# Altium project Basic FPGA.PrjPcb (part 1 of 2)
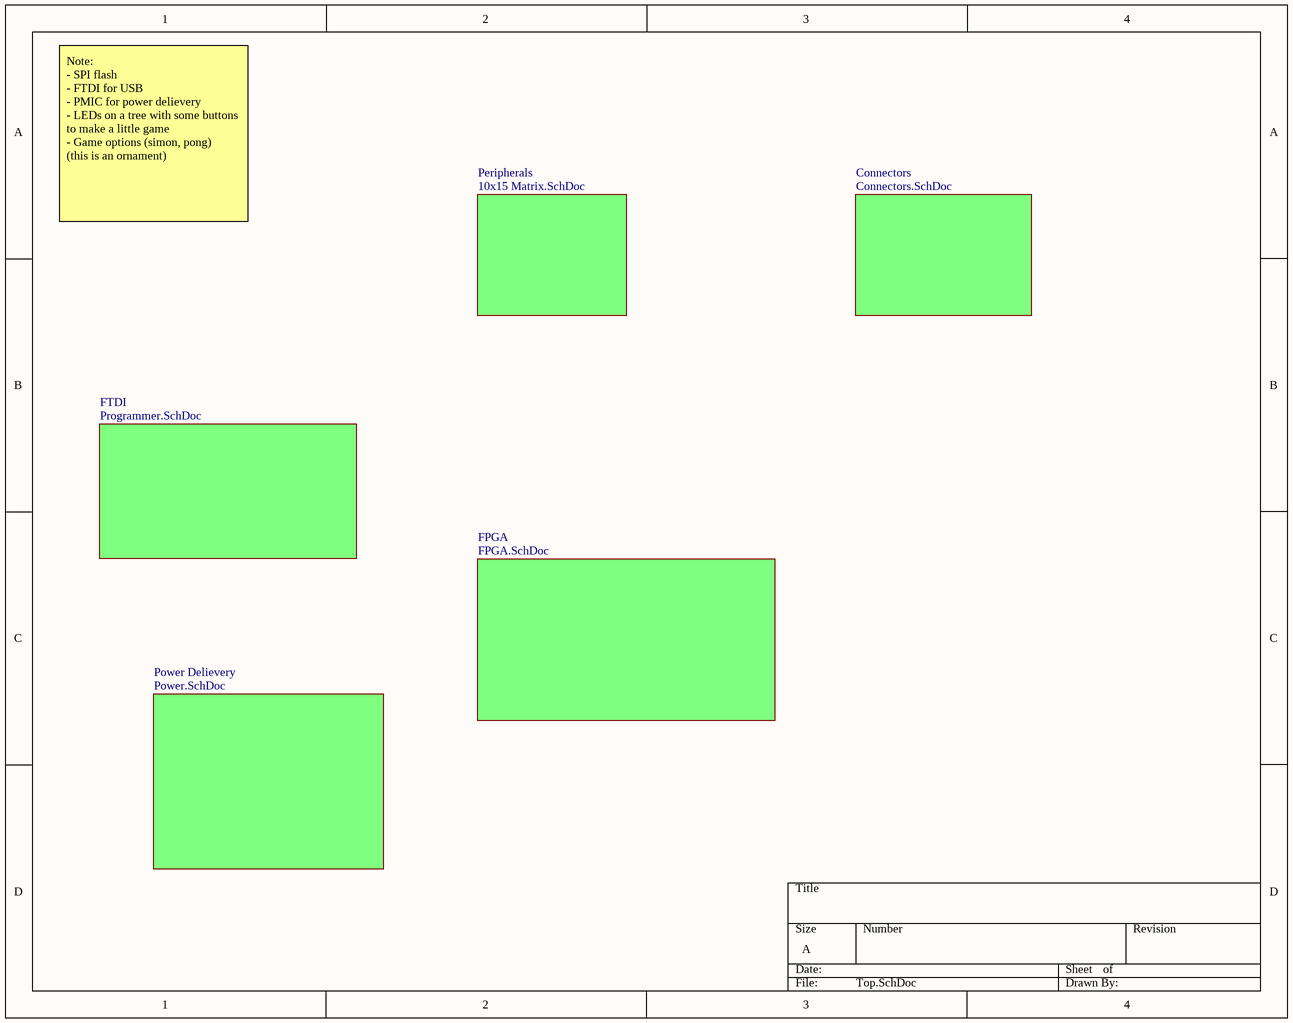
[diagram p0: Top.SchDoc]
6 sheets, 251 parts. Net scope: flat (ports and power ports of the same name join across sheets).
Board files: DevBoard.PcbDoc, Copy of ProductionBoard.PcbDoc, LEDMatrix.PcbDoc
Sheets:
  Top.SchDoc
    FPGA = FPGA.SchDoc
    FTDI = Programmer.SchDoc
    Peripherals = 10x15 Matrix.SchDoc
    Connectors = Connectors.SchDoc
    Power Delievery = Power.SchDoc

## Sheet Top.SchDoc
size A

### Sub-sheets
Connectors = Connectors.SchDoc: no entries
FPGA = FPGA.SchDoc: no entries
FTDI = Programmer.SchDoc: no entries
Peripherals = 10x15 Matrix.SchDoc: no entries
Power Delievery = Power.SchDoc: no entries

### Notes on the sheet
- Note:
  - SPI flash
  - FTDI for USB
  - PMIC for power delievery
  - LEDs on a tree with some buttons to make a little game
  - Game options (simon, pong)
  (this is an ornament)

## Sheet FPGA.SchDoc
size A
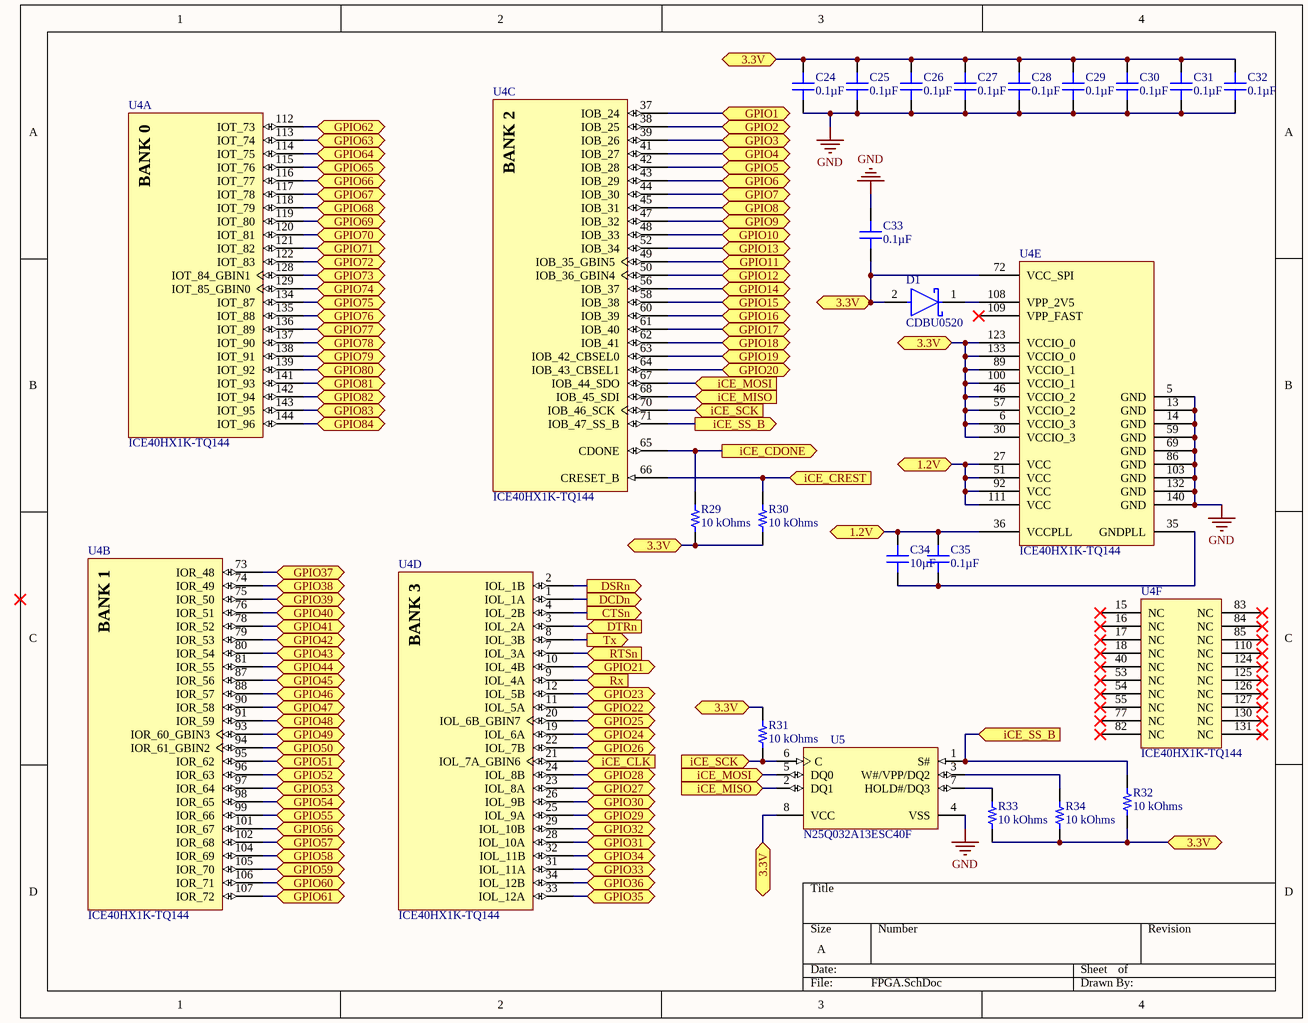
[diagram p1: FPGA.SchDoc]

### Parts
C24  0.1µF  [CAP 0805_2012]
C25  0.1µF  [CAP 0805_2012]
C26  0.1µF  [CAP 0805_2012]
C27  0.1µF  [CAP 0805_2012]
C28  0.1µF  [CAP 0805_2012]
C29  0.1µF  [CAP 0805_2012]
C30  0.1µF  [CAP 0805_2012]
C31  0.1µF  [CAP 0805_2012]
C32  0.1µF  [CAP 0805_2012]
C33  0.1µF  [CAP 0805_2012]
C34  10µF  [CAP 0805_2012]
C35  0.1µF  [CAP 0805_2012]
D1  CDBU0520  [FP-0603-SOD-523F-MFG]
R29  10 kOhms  [RES 0805_2012]
R30  10 kOhms  [RES 0805_2012]
R31  10 kOhms  [RES 0805_2012]
R32  10 kOhms  [RES 0805_2012]
R33  10 kOhms  [RES 0805_2012]
R34  10 kOhms  [RES 0805_2012]
U4  ICE40HX1K-TQ144  [LATC-TQFP-144_L]  (parts A,B,C,D,E,F of 6)
U5  N25Q032A13ESC40F  [MICT-SC-8_N]

### Ports
1.2V (bidir), 3.3V (bidir), CTSn (out), DCDn (out), DSRn (out), DTRn (in), GPIO1 (bidir), GPIO2 (bidir), GPIO3 (bidir), GPIO4 (bidir), GPIO5 (bidir), GPIO6 (bidir), GPIO7 (bidir), GPIO8 (bidir), GPIO9 (bidir), GPIO10 (bidir), GPIO11 (bidir), GPIO12 (bidir), GPIO13 (bidir), GPIO14 (bidir), GPIO15 (bidir), GPIO16 (bidir), GPIO17 (bidir), GPIO18 (bidir), GPIO19 (bidir), GPIO20 (bidir), GPIO21 (bidir), GPIO22 (bidir), GPIO23 (bidir), GPIO24 (bidir), GPIO25 (bidir), GPIO26 (bidir), GPIO27 (bidir), GPIO28 (bidir), GPIO29 (bidir), GPIO30 (bidir), GPIO31 (bidir), GPIO32 (bidir), GPIO33 (bidir), GPIO34 (bidir), GPIO35 (bidir), GPIO36 (bidir), GPIO37 (bidir), GPIO38 (bidir), GPIO39 (bidir), GPIO40 (bidir), GPIO41 (bidir), GPIO42 (bidir), GPIO43 (bidir), GPIO44 (bidir), GPIO45 (bidir), GPIO46 (bidir), GPIO47 (bidir), GPIO48 (bidir), GPIO49 (bidir), GPIO50 (bidir), GPIO51 (bidir), GPIO52 (bidir), GPIO53 (bidir), GPIO54 (bidir), GPIO55 (bidir), GPIO56 (bidir), GPIO57 (bidir), GPIO58 (bidir), GPIO59 (bidir), GPIO60 (bidir), GPIO61 (bidir), GPIO62 (bidir), GPIO63 (bidir), GPIO64 (bidir), GPIO65 (bidir), GPIO66 (bidir), GPIO67 (bidir), GPIO68 (bidir), GPIO69 (bidir), GPIO70 (bidir), GPIO71 (bidir), GPIO72 (bidir), GPIO73 (bidir), GPIO74 (bidir), GPIO75 (bidir), GPIO76 (bidir), GPIO77 (bidir), GPIO78 (bidir), GPIO79 (bidir), GPIO80 (bidir), GPIO81 (bidir), GPIO82 (bidir), GPIO83 (bidir), GPIO84 (bidir), iCE_CDONE (out), iCE_CLK (in), iCE_CREST (in), iCE_MISO (in), iCE_MOSI (in), iCE_SCK (in), iCE_SS_B (in), iCE_SS_B (out), RTSn (in), Rx (in), Tx (out)

### Nets
GND: C24.1 C25.1 C26.1 C27.1 C28.1 C29.1 C30.1 C31.1 C32.1 C33.2 U4.5(GND) U4.13(GND) U4.14(GND) U4.59(GND) U4.69(GND) U4.86(GND) U4.103(GND) U4.132(GND) U4.140(GND) U5.4(VSS)
Net*_4: C24.2 C25.2 C26.2 C27.2 C28.2 C29.2 C30.2 C31.2 C32.2 C33.1 D1.2(A) R29.2 R30.2 R31.2 R32.1 R33.1 R34.1 U4.6(VCCIO_3) U4.30(VCCIO_3) U4.46(VCCIO_2) U4.57(VCCIO_2) U4.72(VCC_SPI) U4.89(VCCIO_1) U4.100(VCCIO_1) U4.123(VCCIO_0) U4.133(VCCIO_0) U5.8(VCC) ; port 3.3V
NetC1_2: C34.2 C35.2 U4.27(VCC) U4.36(VCCPLL) U4.51(VCC) U4.92(VCC) U4.111(VCC) ; port 1.2V
NetC34_1: C34.1 C35.1 U4.35(GNDPLL)
NetD1_1: D1.1(C) U4.108(VPP_2V5)
NetD2_1: U4.73(IOR_48) ; port GPIO37
NetD17_1: U4.74(IOR_49) ; port GPIO38
NetD32_1: U4.75(IOR_50) ; port GPIO39
NetD47_1: U4.76(IOR_51) ; port GPIO40
NetD62_1: U4.78(IOR_52) ; port GPIO41
NetD77_1: U4.79(IOR_53) ; port GPIO42
NetD92_1: U4.80(IOR_54) ; port GPIO43
NetD107_1: U4.81(IOR_55) ; port GPIO44
NetD122_1: U4.87(IOR_56) ; port GPIO45
NetD137_1: U4.88(IOR_57) ; port GPIO46
NetP1_1: U4.112(IOT_73) ; port GPIO62
NetP1_2: U4.113(IOT_74) ; port GPIO63
NetP1_3: U4.114(IOT_75) ; port GPIO64
NetP1_4: U4.115(IOT_76) ; port GPIO65
NetP1_5: U4.116(IOT_77) ; port GPIO66
NetP1_6: U4.117(IOT_78) ; port GPIO67
NetP1_7: U4.118(IOT_79) ; port GPIO68
NetP1_8: U4.119(IOT_80) ; port GPIO69
NetP1_9: U4.120(IOT_81) ; port GPIO70
NetP1_10: U4.121(IOT_82) ; port GPIO71
NetP1_11: U4.122(IOT_83) ; port GPIO72
NetP1_12: U4.128(IOT_84_GBIN1) ; port GPIO73
NetP1_13: U4.129(IOT_85_GBIN0) ; port GPIO74
NetP3_1: U4.37(IOB_24) ; port GPIO1
NetP3_2: U4.38(IOB_25) ; port GPIO2
NetP3_3: U4.39(IOB_26) ; port GPIO3
NetP3_4: U4.41(IOB_27) ; port GPIO4
NetP3_5: U4.42(IOB_28) ; port GPIO5
NetP3_6: U4.43(IOB_29) ; port GPIO6
NetP3_7: U4.44(IOB_30) ; port GPIO7
NetP3_8: U4.45(IOB_31) ; port GPIO8
NetP3_9: U4.47(IOB_32) ; port GPIO9
NetP3_10: U4.48(IOB_33) ; port GPIO10
NetP4_1: U4.10(IOL_4B) ; port GPIO21
NetP4_2: U4.11(IOL_5A) ; port GPIO22
NetP4_3: U4.12(IOL_5B) ; port GPIO23
NetP4_4: U4.19(IOL_6A) ; port GPIO24
NetP4_5: U4.20(IOL_6B_GBIN7) ; port GPIO25
NetP4_6: U4.22(IOL_7B) ; port GPIO26
NetP4_7: U4.23(IOL_8A) ; port GPIO27
NetP4_8: U4.24(IOL_8B) ; port GPIO28
NetP4_9: U4.25(IOL_9A) ; port GPIO29
NetP4_10: U4.26(IOL_9B) ; port GPIO30
NetP4_11: U4.28(IOL_10A) ; port GPIO31
NetP4_12: U4.29(IOL_10B) ; port GPIO32
NetP4_13: U4.31(IOL_11A) ; port GPIO33
NetP4_14: U4.32(IOL_11B) ; port GPIO34
NetP4_15: U4.33(IOL_12A) ; port GPIO35
NetP4_16: U4.34(IOL_12B) ; port GPIO36
NetP5_1: U4.134(IOT_87) ; port GPIO75
NetP5_2: U4.135(IOT_88) ; port GPIO76
NetP5_3: U4.136(IOT_89) ; port GPIO77
NetP5_4: U4.137(IOT_90) ; port GPIO78
NetP5_5: U4.138(IOT_91) ; port GPIO79
NetP5_6: U4.139(IOT_92) ; port GPIO80
NetP5_7: U4.141(IOT_93) ; port GPIO81
NetP5_8: U4.142(IOT_94) ; port GPIO82
NetP5_9: U4.143(IOT_95) ; port GPIO83
NetP5_10: U4.144(IOT_96) ; port GPIO84
NetP6_1: U4.90(IOR_58) ; port GPIO47
NetP6_2: U4.91(IOR_59) ; port GPIO48
NetP6_3: U4.93(IOR_60_GBIN3) ; port GPIO49
NetP6_4: U4.94(IOR_61_GBIN2) ; port GPIO50
NetP6_5: U4.95(IOR_62) ; port GPIO51
NetP6_6: U4.96(IOR_63) ; port GPIO52
NetP6_7: U4.97(IOR_64) ; port GPIO53
NetP6_8: U4.98(IOR_65) ; port GPIO54
NetP6_9: U4.99(IOR_66) ; port GPIO55
NetP6_10: U4.101(IOR_67) ; port GPIO56
NetP6_11: U4.102(IOR_68) ; port GPIO57
NetP6_12: U4.104(IOR_69) ; port GPIO58
NetP6_13: U4.105(IOR_70) ; port GPIO59
NetP6_14: U4.106(IOR_71) ; port GPIO60
NetP6_15: U4.107(IOR_72) ; port GPIO61
NetP7_1: U4.49(IOB_35_GBIN5) ; port GPIO11
NetP7_2: U4.50(IOB_36_GBIN4) ; port GPIO12
NetP7_3: U4.52(IOB_34) ; port GPIO13
NetP7_4: U4.56(IOB_37) ; port GPIO14
NetP7_5: U4.58(IOB_38) ; port GPIO15
NetP7_6: U4.60(IOB_39) ; port GPIO16
NetP7_7: U4.61(IOB_40) ; port GPIO17
NetP7_8: U4.62(IOB_41) ; port GPIO18
NetP7_9: U4.63(IOB_42_CBSEL0) ; port GPIO19
NetP7_10: U4.64(IOB_43_CBSEL1) ; port GPIO20
NetR9_1: R31.1 U4.70(IOB_46_SCK) U5.6(C) ; port iCE_SCK
NetR10_1: U4.67(IOB_44_SDO) U5.5(DQ0) ; port iCE_MOSI
NetR11_1: U4.68(IOB_45_SDI) U5.2(DQ1) ; port iCE_MISO
NetR12_1: R32.2 U4.71(IOB_47_SS_B) U5.1(S#) ; port iCE_SS_B
NetR13_1: R29.1 U4.65(CDONE) ; port iCE_CDONE
NetR14_1: R30.1 U4.66(CRESET_B) ; port iCE_CREST
NetR20_1: U4.9(IOL_4A) ; port Rx
NetR21_1: U4.8(IOL_3B) ; port Tx
NetR22_1: U4.7(IOL_3A) ; port RTSn
NetR23_1: U4.4(IOL_2B) ; port CTSn
NetR24_1: U4.3(IOL_2A) ; port DTRn
NetR25_1: U4.2(IOL_1B) ; port DSRn
NetR26_1: U4.1(IOL_1A) ; port DCDn
NetR28_1: U4.21(IOL_7A_GBIN6) ; port iCE_CLK
NetR33_2: R33.2 U5.7(HOLD#/DQ3)
NetR34_2: R34.2 U5.3(W#/VPP/DQ2)

Not connected (* = marked no-connect by the designer): U4 15(NC)* 16(NC)* 17(NC)* 18(NC)* 40(NC)* 53(NC)* 54(NC)* 55(NC)* 77(NC)* 82(NC)* 83(NC)* 84(NC)* 85(NC)* 109(VPP_FAST)* 110(NC)* 124(NC)* 125(NC)* 126(NC)* 127(NC)* 130(NC)* 131(NC)*

### Notes on the sheet
- (in symbol CMP-0962-00009-1, part A) BANK 0
- (in symbol CMP-0962-00009-1, part B) BANK 1
- (in symbol CMP-0962-00009-1, part C) BANK 2
- (in symbol CMP-0962-00009-1, part D) BANK 3

### Library data of the parts
C24-C33 C35 = CL21B104KBCNNNC: CAP CER 0.1UF 50V X7R 0805; Manufacturer: Samsung Electro-Mechanics; Tolerance: ±10%; Part Number: CL21B104KBCNNNC; Value: 0.1µF; Applications: General Purpose; Capacitance: 0.1µF; ComponentLink1Description: Datasheet; ComponentLink1URL: http://www.samsungsem.com/kr/support/product-search/mlcc/CL21B104KBCNNNC.jsp; ComponentLink2Description: DigiKey Link; ComponentLink2URL: http://digikey.com/product-detail/en/samsung-electro-mechanics/CL21B104KBCNNNC/1276-1003-1-ND/3889089; Device Package: 0805 (2012 Metric); LastUpdated: 9/2/2020 1:04:35 AM; Lifecycle Status: Active; Minimum Order: 1; Mounting Type: Surface Mount, MLCC; Operating Temperature: -55°C ~ 125°C; Package / Case: 0805 (2012 Metric); Packaging: TapeAndReel; PartId: 6201; Part Status: Active; Price: 0.01; Series: CL; Size / Dimension: 0.079" L x 0.049" W (2.00mm x 1.25mm); Supplier 1: DigiKey; Supplier Part Number 1: 1276-1003-1-ND; Temperature Coefficient: X7R; Thickness (Max): 0.037" (0.95mm); Voltage - Rated: 50V
C34 = CL21A106KOQNNNG: CAP CER 10UF 16V X5R 0805; Manufacturer: Samsung Electro-Mechanics; Tolerance: ±10%; Part Number: CL21A106KOQNNNG; Value: 10µF; Applications: General Purpose; Capacitance: 10µF; ComponentLink1Description: Datasheet; ComponentLink1URL: http://www.samsungsem.com/kr/support/product-search/mlcc/CL21A106KOQNNNG.jsp; ComponentLink2Description: DigiKey Link; ComponentLink2URL: http://digikey.com/product-detail/en/samsung-electro-mechanics/CL21A106KOQNNNG/1276-6455-1-ND/5958083; Device Package: 0805 (2012 Metric); LastUpdated: 9/2/2020 1:04:35 AM; Lifecycle Status: Active; Minimum Order: 1; Mounting Type: Surface Mount, MLCC; Operating Temperature: -55°C ~ 85°C; Package / Case: 0805 (2012 Metric); Packaging: TapeAndReel; PartId: 6236; Part Status: Active; Price: 0.02; Series: CL; Size / Dimension: 0.079" L x 0.049" W (2.00mm x 1.25mm); Supplier 1: DigiKey; Supplier Part Number 1: 1276-6455-1-ND; Temperature Coefficient: X5R; Thickness (Max): 0.055" (1.40mm); Voltage - Rated: 16V
D1 = CMP-20227-000003-1: DIODE SCHOTTKY 20V 500MA 0603; Max Surge Current: 2A; Max Reverse Leakage Current: 100uA; Package Quantity: 1; Packaging: Tape and Reel; Mount: Surface Mount; Max Reverse Voltage (DC): 20V; Average Rectified Current: 500mA; Case/Package: SMD/SMT
R29-R34 = RNCP0805FTD10K0: RES 10K OHM 1% 1/4W 0805; Manufacturer: Stackpole Electronics Inc; Power (Watts): 0.25W, 1/4W; Temperature Coefficient: ±100ppm/°C; Part Number: RNCP0805FTD10K0; Value: 10 kOhms; ComponentLink1Description: Datasheet; ComponentLink1URL: https://www.seielect.com/catalog/sei-rncp.pdf; ComponentLink2Description: DigiKey Link; ComponentLink2URL: http://digikey.com/product-detail/en/stackpole-electronics-inc/RNCP0805FTD10K0/RNCP0805FTD10K0CT-ND/2240601; Composition: Thin Film; Device Package: 0805 (2012 Metric); Features: Anti-Sulfur, Moisture Resistant; Height - Seated (Max): 0.024" (0.60mm); LastUpdated: 9/2/2020 1:15:23 AM; Lifecycle Status: Active; Minimum Order: 1; Number of Terminations: 2; Operating Temperature: -55°C ~ 155°C; Package / Case: 0805 (2012 Metric); Packaging: TapeAndReel; PartId: 28021; Part Status: Active; Price: 0.01; Resistance: 10 kOhms; Series: RNCP; Size / Dimension: 0.079" L x 0.049" W (2.00mm x 1.25mm); Supplier 1: DigiKey; Supplier Part Number 1: RNCP0805FTD10K0CT-ND; Supplier Device Package: 0805; Tolerance: ±1%
U4 = CMP-0962-00009-1: iCE40 HX1K Series FPGA Family, 1280 Logic Cells, 1.2 V Core, 64 K Embedded RAM Bits, 144-pin TQFP, Pb-Free, Tray; Manufacturer: Lattice Semiconductor; Embedded RAM Bits: 64K; Logic Cells: 1280; Phase-Locked Loops: 1; Supply Voltage: 1.2V; Mounting Technology: Surface Mount; ComponentLink3URL: http://www.latticesemi.com/lit/docs/package/pkg.pdf; ComponentLink1URL: http://www.latticesemi.com/en; ComponentLink2Description: Datasheet; RoHS: TRUE; ComponentLink2URL: http://www.latticesemi.com/~/media/Documents/DataSheets/iCE/iCE40LPHXFamilyDataSheet.pdf; PackageVersion: Rev. 03.9, 02/2013; ComponentLink1Description: Manufacturer URL; PartNumber: ICE40HX1K-TQ144; DatasheetVersion: Rev. 02.9; PackageReference: TQFP-144; PackageDescription: 144-Pin Thin Quad Flat Package, Body 20 x 20 mm, Pitch 0.5 mm; Packing: Tray; ComponentLink3Description: Package Specification
U5 = CMP-0357-00152-1: 32 Mb (x1/x2/x4) Serial NOR Flash Memory with Multi I/O, 108 MHz, 2.7 to 3.6 V, 8-pin SO8 Narrow (SC), Tape & Reel; Manufacturer: Micron; Part Family: N25QÂ; Density: 32MbÂ; Speed: 108 MHzÂ; Voltage: 2.7V-3.6VÂ; PackageReference: MICT-SC-8; Width: x1/x2/x4Â; Mounting Technology: Surface Mount; ComponentLink2Description: Datasheet; PackageVersion: Rev. E; ComponentLink1Description: Manufacturer URL; PackageDescription: 8-Pin SO Narrow, 3.9 X 4.9 mm, Pitch 1.27 mm; ComponentLink2URL: http://www.micron.com/~/media/Documents/Products/Data%20Sheet/NOR%20Flash/Serial%20NOR/N25Q/n25q_32mb_3v_65nm.pdf; Part Status: ProductionÂ; Applications: EmbeddedÂ; ComponentLink1URL: http://www.micron.com/; PartNumber: N25Q032A13ESC40F; ComponentLink3Description: Package Specification; ComponentLink3URL: http://www.micron.com/~/media/Documents/Products/Data%20Sheet/NOR%20Flash/Serial%20NOR/N25Q/n25q_32mb_3v_65nm.pdf; Package: SO8 NarrowÂ; Type: Multi I/OÂ; DatasheetVersion: Rev. G; RoHS: YesÂ

## Sheet Programmer.SchDoc
size A
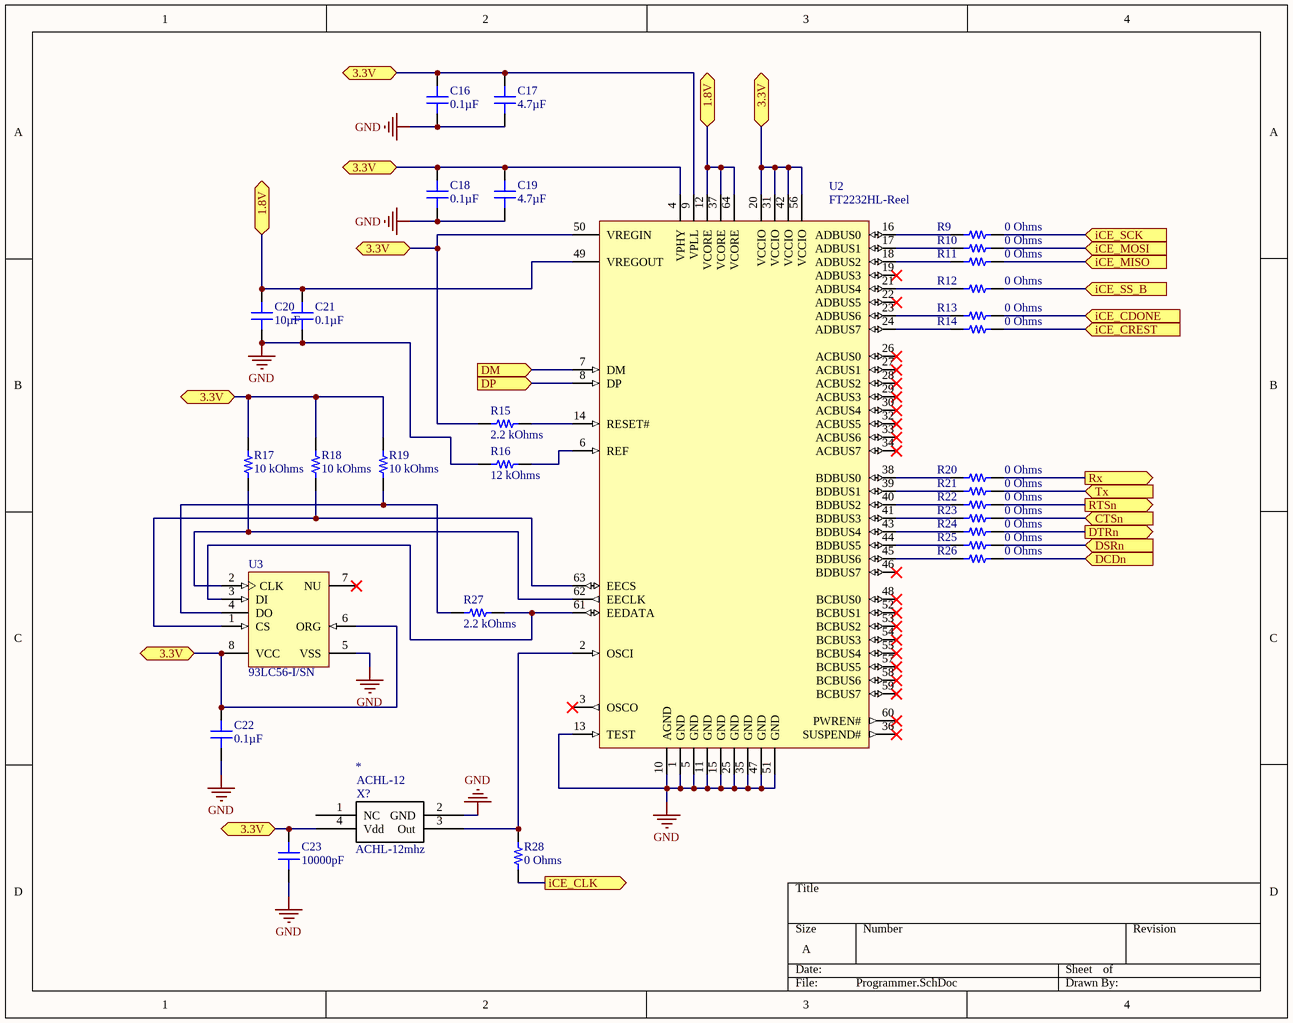
[diagram p2: Programmer.SchDoc]

### Parts
*  ACHL-12mhz  [ACHL-12mhz]
C16  0.1µF  [CAP 0805_2012]
C17  4.7µF  [CAP 0805_2012]
C18  0.1µF  [CAP 0805_2012]
C19  4.7µF  [CAP 0805_2012]
C20  10µF  [CAP 0805_2012]
C21  0.1µF  [CAP 0805_2012]
C22  0.1µF  [CAP 0805_2012]
C23  10000pF  [CAP 0805_2012]
R9  0 Ohms  [RES 0805_2012]
R10  0 Ohms  [RES 0805_2012]
R11  0 Ohms  [RES 0805_2012]
R12  0 Ohms  [RES 0805_2012]
R13  0 Ohms  [RES 0805_2012]
R14  0 Ohms  [RES 0805_2012]
R15  2.2 kOhms  [RES 0805_2012]
R16  12 kOhms  [RES 0805_2012]
R17  10 kOhms  [RES 0805_2012]
R18  10 kOhms  [RES 0805_2012]
R19  10 kOhms  [RES 0805_2012]
R20  0 Ohms  [RES 0805_2012]
R21  0 Ohms  [RES 0805_2012]
R22  0 Ohms  [RES 0805_2012]
R23  0 Ohms  [RES 0805_2012]
R24  0 Ohms  [RES 0805_2012]
R25  0 Ohms  [RES 0805_2012]
R26  0 Ohms  [RES 0805_2012]
R27  2.2 kOhms  [RES 0805_2012]
R28  0 Ohms  [RES 0805_2012]
U2  FT2232HL-Reel  [LQFP-64_M]
U3  93LC56-I/SN  [MCHP-SOIC-SN8_N]

### Ports
1.8V (bidir), 3.3V (bidir), CTSn (in), DCDn (in), DM (in), DP (in), DSRn (in), DTRn (out), iCE_CDONE (in), iCE_CLK (out), iCE_CREST (in), iCE_MISO (in), iCE_MOSI (in), iCE_SCK (in), iCE_SS_B (in), RTSn (out), Rx (out), Tx (in)

### Nets
GND: *.2(GND) C16.1 C17.1 C18.1 C19.1 C20.1 C21.1 C22.1 C23.1 R16.1 U2.1(GND) U2.5(GND) U2.10(AGND) U2.11(GND) U2.13(TEST) U2.15(GND) U2.25(GND) U2.35(GND) U2.47(GND) U2.51(GND) U3.5(VSS)
Net*_3: *.3(Out) R28.2 U2.2(OSCI)
Net*_4: *.4(Vdd) C16.2 C17.2 C18.2 C19.2 C22.2 C23.2 R15.1 R17.2 R18.2 R19.2 U2.4(VPHY) U2.9(VPLL) U2.20(VCCIO) U2.31(VCCIO) U2.42(VCCIO) U2.50(VREGIN) U2.56(VCCIO) U3.6(ORG) U3.8(VCC) ; port 3.3V
NetC20_2: C20.2 C21.2 U2.12(VCORE) U2.37(VCORE) U2.49(VREGOUT) U2.64(VCORE) ; port 1.8V
NetJ1_2: U2.7(DM) ; port DM
NetJ1_3: U2.8(DP) ; port DP
NetR9_1: R9.1 ; port iCE_SCK
NetR9_2: R9.2 U2.16(ADBUS0)
NetR10_1: R10.1 ; port iCE_MOSI
NetR10_2: R10.2 U2.17(ADBUS1)
NetR11_1: R11.1 ; port iCE_MISO
NetR11_2: R11.2 U2.18(ADBUS2)
NetR12_1: R12.1 ; port iCE_SS_B
NetR12_2: R12.2 U2.21(ADBUS4)
NetR13_1: R13.1 ; port iCE_CDONE
NetR13_2: R13.2 U2.23(ADBUS6)
NetR14_1: R14.1 ; port iCE_CREST
NetR14_2: R14.2 U2.24(ADBUS7)
NetR15_2: R15.2 U2.14(RESET#)
NetR16_2: R16.2 U2.6(REF)
NetR17_1: R17.1 U2.62(EECLK) U3.2(CLK)
NetR18_1: R18.1 U2.63(EECS) U3.1(CS)
NetR19_1: R19.1 R27.1 U3.4(DO)
NetR20_1: R20.1 ; port Rx
NetR20_2: R20.2 U2.38(BDBUS0)
NetR21_1: R21.1 ; port Tx
NetR21_2: R21.2 U2.39(BDBUS1)
NetR22_1: R22.1 ; port RTSn
NetR22_2: R22.2 U2.40(BDBUS2)
NetR23_1: R23.1 ; port CTSn
NetR23_2: R23.2 U2.41(BDBUS3)
NetR24_1: R24.1 ; port DTRn
NetR24_2: R24.2 U2.43(BDBUS4)
NetR25_1: R25.1 ; port DSRn
NetR25_2: R25.2 U2.44(BDBUS5)
NetR26_1: R26.1 ; port DCDn
NetR26_2: R26.2 U2.45(BDBUS6)
NetR27_2: R27.2 U2.61(EEDATA) U3.3(DI)
NetR28_1: R28.1 ; port iCE_CLK

Not connected (* = marked no-connect by the designer): * 1(NC); U2 3(OSCO)* 19(ADBUS3)* 22(ADBUS5)* 26(ACBUS0)* 27(ACBUS1)* 28(ACBUS2)* 29(ACBUS3)* 30(ACBUS4)* 32(ACBUS5)* 33(ACBUS6)* 34(ACBUS7)* 36(SUSPEND#)* 46(BDBUS7)* 48(BCBUS0)* 52(BCBUS1)* 53(BCBUS2)* 54(BCBUS3)* 55(BCBUS4)* 57(BCBUS5)* 58(BCBUS6)* 59(BCBUS7)* 60(PWREN#)*; U3 7(NU)*

### Notes on the sheet
- (in symbol ACHL-12mhz) ACHL-12; X?

### Library data of the parts
C16 C18 C21 C22 = CL21B104KBCNNNC: as C24 on sheet FPGA; Part Number: CL21B104KBCNNNC; Value: 0.1µF; Applications: General Purpose; Capacitance: 0.1µF; ComponentLink1Description: Datasheet; ComponentLink1URL: http://www.samsungsem.com/kr/support/product-search/mlcc/CL21B104KBCNNNC.jsp; ComponentLink2Description: DigiKey Link; ComponentLink2URL: http://digikey.com/product-detail/en/samsung-electro-mechanics/CL21B104KBCNNNC/1276-1003-1-ND/3889089; Device Package: 0805 (2012 Metric); LastUpdated: 9/2/2020 1:04:35 AM; Lifecycle Status: Active; Minimum Order: 1; Mounting Type: Surface Mount, MLCC; Operating Temperature: -55°C ~ 125°C; Package / Case: 0805 (2012 Metric); Packaging: TapeAndReel; PartId: 6201; Part Status: Active; Price: 0.01; Series: CL; Size / Dimension: 0.079" L x 0.049" W (2.00mm x 1.25mm); Supplier 1: DigiKey; Supplier Part Number 1: 1276-1003-1-ND; Temperature Coefficient: X7R; Thickness (Max): 0.037" (0.95mm); Voltage - Rated: 50V
C17 C19 = CL21A475KAQNNNE: CAP CER 4.7UF 25V X5R 0805; Manufacturer: Samsung Electro-Mechanics; Tolerance: ±10%; Part Number: CL21A475KAQNNNE; Value: 4.7µF; Applications: General Purpose; Capacitance: 4.7µF; ComponentLink1Description: Datasheet; ComponentLink1URL: http://www.samsungsem.com/kr/support/product-search/mlcc/CL21A475KAQNNNE.jsp; ComponentLink2Description: DigiKey Link; ComponentLink2URL: http://digikey.com/product-detail/en/samsung-electro-mechanics/CL21A475KAQNNNE/1276-1244-1-ND/3889330; Device Package: 0805 (2012 Metric); LastUpdated: 9/2/2020 1:04:19 AM; Lifecycle Status: Active; Minimum Order: 1; Mounting Type: Surface Mount, MLCC; Operating Temperature: -55°C ~ 85°C; Package / Case: 0805 (2012 Metric); Packaging: TapeAndReel; PartId: 14321; Part Status: Active; Price: 0.03; Series: CL; Size / Dimension: 0.079" L x 0.049" W (2.00mm x 1.25mm); Supplier 1: DigiKey; Supplier Part Number 1: 1276-1244-1-ND; Temperature Coefficient: X5R; Thickness (Max): 0.055" (1.40mm); Voltage - Rated: 25V
C20 = CL21A106KOQNNNG: as C34 on sheet FPGA; Part Number: CL21A106KOQNNNG; Value: 10µF; Applications: General Purpose; Capacitance: 10µF; ComponentLink1Description: Datasheet; ComponentLink1URL: http://www.samsungsem.com/kr/support/product-search/mlcc/CL21A106KOQNNNG.jsp; ComponentLink2Description: DigiKey Link; ComponentLink2URL: http://digikey.com/product-detail/en/samsung-electro-mechanics/CL21A106KOQNNNG/1276-6455-1-ND/5958083; Device Package: 0805 (2012 Metric); LastUpdated: 9/2/2020 1:04:35 AM; Lifecycle Status: Active; Minimum Order: 1; Mounting Type: Surface Mount, MLCC; Operating Temperature: -55°C ~ 85°C; Package / Case: 0805 (2012 Metric); Packaging: TapeAndReel; PartId: 6236; Part Status: Active; Price: 0.02; Series: CL; Size / Dimension: 0.079" L x 0.049" W (2.00mm x 1.25mm); Supplier 1: DigiKey; Supplier Part Number 1: 1276-6455-1-ND; Temperature Coefficient: X5R; Thickness (Max): 0.055" (1.40mm); Voltage - Rated: 16V
C23 = CL21B103KBANNNC: CAP CER 10000PF 50V X7R 0805; Manufacturer: Samsung Electro-Mechanics; Tolerance: ±10%; Part Number: CL21B103KBANNNC; Value: 10000pF; Applications: General Purpose; Capacitance: 10000pF; ComponentLink1Description: Datasheet; ComponentLink1URL: http://www.samsungsem.com/kr/support/product-search/mlcc/CL21B103KBANNNC.jsp; ComponentLink2Description: DigiKey Link; ComponentLink2URL: http://digikey.com/product-detail/en/samsung-electro-mechanics/CL21B103KBANNNC/1276-1015-1-ND/3889101; Device Package: 0805 (2012 Metric); LastUpdated: 9/2/2020 1:04:35 AM; Lifecycle Status: Active; Minimum Order: 1; Mounting Type: Surface Mount, MLCC; Operating Temperature: -55°C ~ 125°C; Package / Case: 0805 (2012 Metric); Packaging: TapeAndReel; PartId: 6199; Part Status: Active; Price: 0.01; Series: CL; Size / Dimension: 0.079" L x 0.049" W (2.00mm x 1.25mm); Supplier 1: DigiKey; Supplier Part Number 1: 1276-1015-1-ND; Temperature Coefficient: X7R; Thickness (Max): 0.030" (0.75mm); Voltage - Rated: 50V
R9-R14 R20-R26 R28 = RMCF0805ZT0R00: RES 0 OHM JUMPER 1/8W 0805; Manufacturer: Stackpole Electronics Inc; Power (Watts): 0.125W, 1/8W; Part Number: RMCF0805ZT0R00; Value: 0 Ohms; ComponentLink1Description: Datasheet; ComponentLink1URL: https://www.seielect.com/catalog/sei-packaging.pdf; ComponentLink2Description: DigiKey Link; ComponentLink2URL: http://digikey.com/product-detail/en/stackpole-electronics-inc/RMCF0805ZT0R00/RMCF0805ZT0R00CT-ND/1942606; Composition: Thick Film; Device Package: 0805 (2012 Metric); Features: Automotive AEC-Q200; Height - Seated (Max): 0.026" (0.65mm); LastUpdated: 9/2/2020 1:14:43 AM; Lifecycle Status: Active; Minimum Order: 1; Number of Terminations: 2; Operating Temperature: -55°C ~ 155°C; Package / Case: 0805 (2012 Metric); Packaging: CutTape; PartId: 46079; Part Status: Active; Price: 0.10; Ratings: AEC-Q200; Resistance: 0 Ohms; Series: RMCF; Size / Dimension: 0.079" L x 0.049" W (2.00mm x 1.25mm); Supplier 1: DigiKey; Supplier Part Number 1: RMCF0805ZT0R00CT-ND; Supplier Device Package: 0805; Tolerance: Jumper
R15 R27 = ESR10EZPJ222: RES SMD 2.2K OHM 5% 0.4W 0805; Manufacturer: Rohm Semiconductor; Power (Watts): 0.4W, 2/5W; Temperature Coefficient: ±200ppm/°C; Part Number: ESR10EZPJ222; Value: 2.2 kOhms; ComponentLink1Description: Datasheet; ComponentLink1URL: https://www.rohm.com/datasheet/ESR01MZPF/esr-e; ComponentLink2Description: DigiKey Link; ComponentLink2URL: http://digikey.com/product-detail/en/rohm-semiconductor/ESR10EZPJ222/RHM2.2KKCT-ND/1762991; Composition: Thick Film; Device Package: 0805 (2012 Metric); Features: Automotive AEC-Q200, Pulse Withstanding; Height - Seated (Max): 0.026" (0.65mm); LastUpdated: 9/2/2020 1:15:14 AM; Lifecycle Status: Active; Minimum Order: 1; Number of Terminations: 2; Operating Temperature: -55°C ~ 155°C; Package / Case: 0805 (2012 Metric); Packaging: TapeAndReel; PartId: 32275; Part Status: Active; Price: 0.01; Ratings: AEC-Q200; Resistance: 2.2 kOhms; Series: ESR; Size / Dimension: 0.079" L x 0.049" W (2.00mm x 1.25mm); Supplier 1: DigiKey; Supplier Part Number 1: RHM2.2KKCT-ND; Supplier Device Package: 0805; Tolerance: ±5%
R16 = CRG0805F12K: RES SMD 12K OHM 1% 1/8W 0805; Manufacturer: TE Connectivity Passive Product; Power (Watts): 0.125W, 1/8W; Temperature Coefficient: ±100ppm/°C; Part Number: CRG0805F12K; Value: 12 kOhms; ComponentLink1Description: Datasheet; ComponentLink1URL: https://www.te.com/commerce/DocumentDelivery/DDEController?Action=srchrtrv&DocNm=1773204&DocType=DS&DocLang=English; ComponentLink2Description: DigiKey Link; ComponentLink2URL: http://digikey.com/product-detail/en/te-connectivity-passive-product/CRG0805F12K/A126337CT-ND/7603392; Composition: Thick Film; Device Package: 0805 (2012 Metric); Height - Seated (Max): 0.026" (0.65mm); LastUpdated: 9/2/2020 1:14:43 AM; Lifecycle Status: Active; Minimum Order: 1; Number of Terminations: 2; Operating Temperature: -55°C ~ 155°C; Package / Case: 0805 (2012 Metric); Packaging: TapeAndReel; PartId: 46149; Part Status: Active; Price: 0.01; Resistance: 12 kOhms; Series: CRG, Neohm; Size / Dimension: 0.079" L x 0.049" W (2.00mm x 1.25mm); Supplier 1: DigiKey; Supplier Part Number 1: A126337CT-ND; Supplier Device Package: 0805; Tolerance: ±1%
R17-R19 = RNCP0805FTD10K0: as R29 on sheet FPGA; Part Number: RNCP0805FTD10K0; Value: 10 kOhms; ComponentLink1Description: Datasheet; ComponentLink1URL: https://www.seielect.com/catalog/sei-rncp.pdf; ComponentLink2Description: DigiKey Link; ComponentLink2URL: http://digikey.com/product-detail/en/stackpole-electronics-inc/RNCP0805FTD10K0/RNCP0805FTD10K0CT-ND/2240601; Composition: Thin Film; Device Package: 0805 (2012 Metric); Features: Anti-Sulfur, Moisture Resistant; Height - Seated (Max): 0.024" (0.60mm); LastUpdated: 9/2/2020 1:15:23 AM; Lifecycle Status: Active; Minimum Order: 1; Number of Terminations: 2; Operating Temperature: -55°C ~ 155°C; Package / Case: 0805 (2012 Metric); Packaging: TapeAndReel; PartId: 28021; Part Status: Active; Price: 0.01; Resistance: 10 kOhms; Series: RNCP; Size / Dimension: 0.079" L x 0.049" W (2.00mm x 1.25mm); Supplier 1: DigiKey; Supplier Part Number 1: RNCP0805FTD10K0CT-ND; Supplier Device Package: 0805; Tolerance: ±1%
U2 = CMP-0078-00023-3: Dual High Speed USB To Multipurpose UART/FIFO IC, 64-pin LQFP, Tape and Reel; Manufacturer: FTDI; DatasheetVersion: ver 2.21, Jun-2012; ComponentLink1URL: http://www.ftdichip.com/; PartNumber: FT2232HL-Reel; ComponentLink2Description: Datasheet; RevisionNote: DatasheetVersion updated to 2.21 Jun-2012; PackageVersion: Jun-12; ComponentLink1Description: Manufacturer URL; ComponentLink2URL: http://www.ftdichip.com/Support/Documents/DataSheets/ICs/DS_FT2232H.pdf; PackageReference: LQFP-64; PackageDescription: 64-Pin Thin Quad Flat Pack, 10 x 10 x 1.4 mm Body, 0.5 mm Pitch
U3 = CMP-0162-00635-1: 2K bits Microwire Serial EEPROM, 2.5 to 5.5 V, 2 MHz, -40 to 85 degC, 8-pin SOIC (SN8), Tube; Manufacturer: Microchip; PartNumber: 93LC56-I/SN; ComponentLink1Description: Manufacturer URL; ComponentLink3Description: Package Specification; ComponentLink4URL: http://www.microchip.com/93LC56; ComponentLink2URL: http://ww1.microchip.com/downloads/en/DeviceDoc/21712B.pdf; ComponentLink1URL: http://www.microchip.com; Mounting Technology: Surface Mount; ComponentLink3URL: http://www.microchip.com/stellent/groups/techpub_sg/documents/packagingspec/en012702.pdf; PackageVersion: C04-057C; DatasheetVersion: Rev. B; ComponentLink2Description: Datasheet; PackageDescription: 8-Lead Plastic Small Outline, 4.9 x 3.9 mm Body, 1.27 mm Pitch; PackageReference: SOIC-SN8; ComponentLink4Description: Product URL

## Sheet 10x15 Matrix.SchDoc
size B
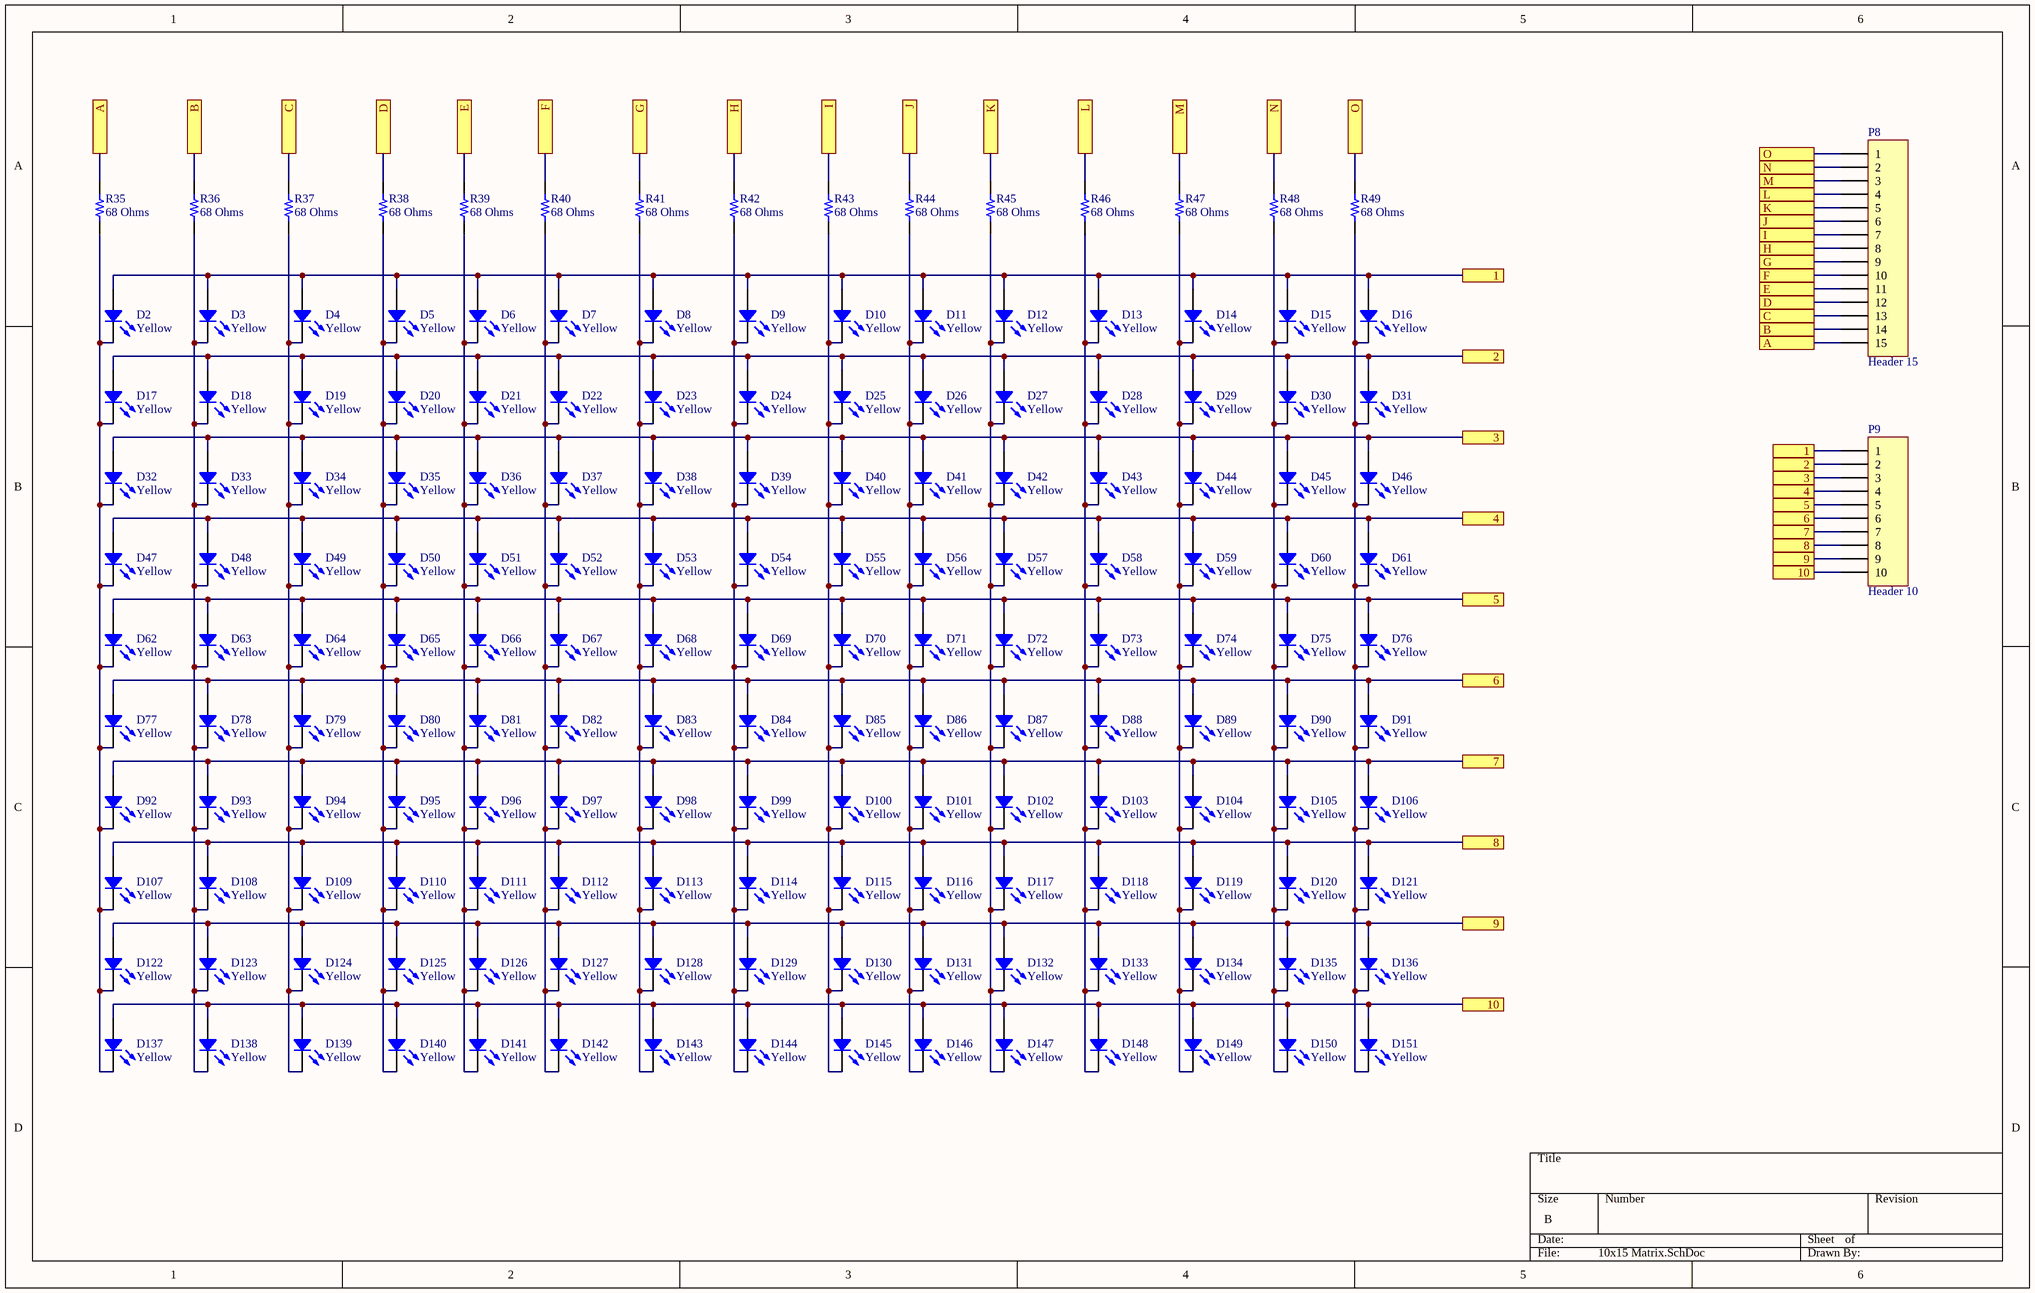
[diagram p3: 10x15 Matrix.SchDoc]

### Parts
D2  Yellow  [LED 0805_2012 YELLOW]
D3  Yellow  [LED 0805_2012 YELLOW]
D4  Yellow  [LED 0805_2012 YELLOW]
D5  Yellow  [LED 0805_2012 YELLOW]
D6  Yellow  [LED 0805_2012 YELLOW]
D7  Yellow  [LED 0805_2012 YELLOW]
D8  Yellow  [LED 0805_2012 YELLOW]
D9  Yellow  [LED 0805_2012 YELLOW]
D10  Yellow  [LED 0805_2012 YELLOW]
D11  Yellow  [LED 0805_2012 YELLOW]
D12  Yellow  [LED 0805_2012 YELLOW]
D13  Yellow  [LED 0805_2012 YELLOW]
D14  Yellow  [LED 0805_2012 YELLOW]
D15  Yellow  [LED 0805_2012 YELLOW]
D16  Yellow  [LED 0805_2012 YELLOW]
D17  Yellow  [LED 0805_2012 YELLOW]
D18  Yellow  [LED 0805_2012 YELLOW]
D19  Yellow  [LED 0805_2012 YELLOW]
D20  Yellow  [LED 0805_2012 YELLOW]
D21  Yellow  [LED 0805_2012 YELLOW]
D22  Yellow  [LED 0805_2012 YELLOW]
D23  Yellow  [LED 0805_2012 YELLOW]
D24  Yellow  [LED 0805_2012 YELLOW]
D25  Yellow  [LED 0805_2012 YELLOW]
D26  Yellow  [LED 0805_2012 YELLOW]
D27  Yellow  [LED 0805_2012 YELLOW]
D28  Yellow  [LED 0805_2012 YELLOW]
D29  Yellow  [LED 0805_2012 YELLOW]
D30  Yellow  [LED 0805_2012 YELLOW]
D31  Yellow  [LED 0805_2012 YELLOW]
D32  Yellow  [LED 0805_2012 YELLOW]
D33  Yellow  [LED 0805_2012 YELLOW]
D34  Yellow  [LED 0805_2012 YELLOW]
D35  Yellow  [LED 0805_2012 YELLOW]
D36  Yellow  [LED 0805_2012 YELLOW]
D37  Yellow  [LED 0805_2012 YELLOW]
D38  Yellow  [LED 0805_2012 YELLOW]
D39  Yellow  [LED 0805_2012 YELLOW]
D40  Yellow  [LED 0805_2012 YELLOW]
D41  Yellow  [LED 0805_2012 YELLOW]
D42  Yellow  [LED 0805_2012 YELLOW]
D43  Yellow  [LED 0805_2012 YELLOW]
D44  Yellow  [LED 0805_2012 YELLOW]
D45  Yellow  [LED 0805_2012 YELLOW]
D46  Yellow  [LED 0805_2012 YELLOW]
D47  Yellow  [LED 0805_2012 YELLOW]
D48  Yellow  [LED 0805_2012 YELLOW]
D49  Yellow  [LED 0805_2012 YELLOW]
D50  Yellow  [LED 0805_2012 YELLOW]
D51  Yellow  [LED 0805_2012 YELLOW]
D52  Yellow  [LED 0805_2012 YELLOW]
D53  Yellow  [LED 0805_2012 YELLOW]
D54  Yellow  [LED 0805_2012 YELLOW]
D55  Yellow  [LED 0805_2012 YELLOW]
D56  Yellow  [LED 0805_2012 YELLOW]
D57  Yellow  [LED 0805_2012 YELLOW]
D58  Yellow  [LED 0805_2012 YELLOW]
D59  Yellow  [LED 0805_2012 YELLOW]
D60  Yellow  [LED 0805_2012 YELLOW]
D61  Yellow  [LED 0805_2012 YELLOW]
D62  Yellow  [LED 0805_2012 YELLOW]
D63  Yellow  [LED 0805_2012 YELLOW]
D64  Yellow  [LED 0805_2012 YELLOW]
D65  Yellow  [LED 0805_2012 YELLOW]
D66  Yellow  [LED 0805_2012 YELLOW]
D67  Yellow  [LED 0805_2012 YELLOW]
D68  Yellow  [LED 0805_2012 YELLOW]
D69  Yellow  [LED 0805_2012 YELLOW]
D70  Yellow  [LED 0805_2012 YELLOW]
D71  Yellow  [LED 0805_2012 YELLOW]
D72  Yellow  [LED 0805_2012 YELLOW]
D73  Yellow  [LED 0805_2012 YELLOW]
D74  Yellow  [LED 0805_2012 YELLOW]
D75  Yellow  [LED 0805_2012 YELLOW]
D76  Yellow  [LED 0805_2012 YELLOW]
D77  Yellow  [LED 0805_2012 YELLOW]
D78  Yellow  [LED 0805_2012 YELLOW]
D79  Yellow  [LED 0805_2012 YELLOW]
D80  Yellow  [LED 0805_2012 YELLOW]
D81  Yellow  [LED 0805_2012 YELLOW]
D82  Yellow  [LED 0805_2012 YELLOW]
D83  Yellow  [LED 0805_2012 YELLOW]
D84  Yellow  [LED 0805_2012 YELLOW]
D85  Yellow  [LED 0805_2012 YELLOW]
D86  Yellow  [LED 0805_2012 YELLOW]
D87  Yellow  [LED 0805_2012 YELLOW]
D88  Yellow  [LED 0805_2012 YELLOW]
D89  Yellow  [LED 0805_2012 YELLOW]
D90  Yellow  [LED 0805_2012 YELLOW]
D91  Yellow  [LED 0805_2012 YELLOW]
D92  Yellow  [LED 0805_2012 YELLOW]
D93  Yellow  [LED 0805_2012 YELLOW]
D94  Yellow  [LED 0805_2012 YELLOW]
D95  Yellow  [LED 0805_2012 YELLOW]
D96  Yellow  [LED 0805_2012 YELLOW]
D97  Yellow  [LED 0805_2012 YELLOW]
D98  Yellow  [LED 0805_2012 YELLOW]
D99  Yellow  [LED 0805_2012 YELLOW]
D100  Yellow  [LED 0805_2012 YELLOW]
D101  Yellow  [LED 0805_2012 YELLOW]
D102  Yellow  [LED 0805_2012 YELLOW]
D103  Yellow  [LED 0805_2012 YELLOW]
D104  Yellow  [LED 0805_2012 YELLOW]
D105  Yellow  [LED 0805_2012 YELLOW]
D106  Yellow  [LED 0805_2012 YELLOW]
D107  Yellow  [LED 0805_2012 YELLOW]
D108  Yellow  [LED 0805_2012 YELLOW]
D109  Yellow  [LED 0805_2012 YELLOW]
D110  Yellow  [LED 0805_2012 YELLOW]
D111  Yellow  [LED 0805_2012 YELLOW]
D112  Yellow  [LED 0805_2012 YELLOW]
D113  Yellow  [LED 0805_2012 YELLOW]
D114  Yellow  [LED 0805_2012 YELLOW]
D115  Yellow  [LED 0805_2012 YELLOW]
D116  Yellow  [LED 0805_2012 YELLOW]
D117  Yellow  [LED 0805_2012 YELLOW]
D118  Yellow  [LED 0805_2012 YELLOW]
D119  Yellow  [LED 0805_2012 YELLOW]
D120  Yellow  [LED 0805_2012 YELLOW]
D121  Yellow  [LED 0805_2012 YELLOW]
D122  Yellow  [LED 0805_2012 YELLOW]
D123  Yellow  [LED 0805_2012 YELLOW]
D124  Yellow  [LED 0805_2012 YELLOW]
D125  Yellow  [LED 0805_2012 YELLOW]
D126  Yellow  [LED 0805_2012 YELLOW]
D127  Yellow  [LED 0805_2012 YELLOW]
D128  Yellow  [LED 0805_2012 YELLOW]
D129  Yellow  [LED 0805_2012 YELLOW]
D130  Yellow  [LED 0805_2012 YELLOW]
D131  Yellow  [LED 0805_2012 YELLOW]
D132  Yellow  [LED 0805_2012 YELLOW]
D133  Yellow  [LED 0805_2012 YELLOW]
D134  Yellow  [LED 0805_2012 YELLOW]
D135  Yellow  [LED 0805_2012 YELLOW]
D136  Yellow  [LED 0805_2012 YELLOW]
D137  Yellow  [LED 0805_2012 YELLOW]
D138  Yellow  [LED 0805_2012 YELLOW]
D139  Yellow  [LED 0805_2012 YELLOW]
D140  Yellow  [LED 0805_2012 YELLOW]
D141  Yellow  [LED 0805_2012 YELLOW]
D142  Yellow  [LED 0805_2012 YELLOW]
D143  Yellow  [LED 0805_2012 YELLOW]
D144  Yellow  [LED 0805_2012 YELLOW]
D145  Yellow  [LED 0805_2012 YELLOW]
D146  Yellow  [LED 0805_2012 YELLOW]
D147  Yellow  [LED 0805_2012 YELLOW]
D148  Yellow  [LED 0805_2012 YELLOW]
D149  Yellow  [LED 0805_2012 YELLOW]
D150  Yellow  [LED 0805_2012 YELLOW]
D151  Yellow  [LED 0805_2012 YELLOW]
P8  Header 15  [HDR1X15]
P9  Header 10  [HDR1X10]
R35  68 Ohms  [RES 0603_1608]
R36  68 Ohms  [RES 0603_1608]
R37  68 Ohms  [RES 0603_1608]
R38  68 Ohms  [RES 0603_1608]
R39  68 Ohms  [RES 0603_1608]
R40  68 Ohms  [RES 0603_1608]
R41  68 Ohms  [RES 0603_1608]
R42  68 Ohms  [RES 0603_1608]
R43  68 Ohms  [RES 0603_1608]
R44  68 Ohms  [RES 0603_1608]
R45  68 Ohms  [RES 0603_1608]
R46  68 Ohms  [RES 0603_1608]
R47  68 Ohms  [RES 0603_1608]
R48  68 Ohms  [RES 0603_1608]
R49  68 Ohms  [RES 0603_1608]

### Ports
1, 2, 3, 4, 5, 6, 7, 8, 9, 10, A, B, C, D, E, F, G, H, I, J, K, L, M, N, O

### Nets
NetD2_1: D2.1 D3.1 D4.1 D5.1 D6.1 D7.1 D8.1 D9.1 D10.1 D11.1 D12.1 D13.1 D14.1 D15.1 D16.1 P9.1 ; port 1
NetD2_2: D2.2 D17.2 D32.2 D47.2 D62.2 D77.2 D92.2 D107.2 D122.2 D137.2 R35.1
NetD3_2: D3.2 D18.2 D33.2 D48.2 D63.2 D78.2 D93.2 D108.2 D123.2 D138.2 R36.1
NetD4_2: D4.2 D19.2 D34.2 D49.2 D64.2 D79.2 D94.2 D109.2 D124.2 D139.2 R37.1
NetD5_2: D5.2 D20.2 D35.2 D50.2 D65.2 D80.2 D95.2 D110.2 D125.2 D140.2 R38.1
NetD6_2: D6.2 D21.2 D36.2 D51.2 D66.2 D81.2 D96.2 D111.2 D126.2 D141.2 R39.1
NetD7_2: D7.2 D22.2 D37.2 D52.2 D67.2 D82.2 D97.2 D112.2 D127.2 D142.2 R40.1
NetD8_2: D8.2 D23.2 D38.2 D53.2 D68.2 D83.2 D98.2 D113.2 D128.2 D143.2 R41.1
NetD9_2: D9.2 D24.2 D39.2 D54.2 D69.2 D84.2 D99.2 D114.2 D129.2 D144.2 R42.1
NetD10_2: D10.2 D25.2 D40.2 D55.2 D70.2 D85.2 D100.2 D115.2 D130.2 D145.2 R43.1
NetD11_2: D11.2 D26.2 D41.2 D56.2 D71.2 D86.2 D101.2 D116.2 D131.2 D146.2 R44.1
NetD12_2: D12.2 D27.2 D42.2 D57.2 D72.2 D87.2 D102.2 D117.2 D132.2 D147.2 R45.1
NetD13_2: D13.2 D28.2 D43.2 D58.2 D73.2 D88.2 D103.2 D118.2 D133.2 D148.2 R46.1
NetD14_2: D14.2 D29.2 D44.2 D59.2 D74.2 D89.2 D104.2 D119.2 D134.2 D149.2 R47.1
NetD15_2: D15.2 D30.2 D45.2 D60.2 D75.2 D90.2 D105.2 D120.2 D135.2 D150.2 R48.1
NetD16_2: D16.2 D31.2 D46.2 D61.2 D76.2 D91.2 D106.2 D121.2 D136.2 D151.2 R49.1
NetD17_1: D17.1 D18.1 D19.1 D20.1 D21.1 D22.1 D23.1 D24.1 D25.1 D26.1 D27.1 D28.1 D29.1 D30.1 D31.1 P9.2 ; port 2
NetD32_1: D32.1 D33.1 D34.1 D35.1 D36.1 D37.1 D38.1 D39.1 D40.1 D41.1 D42.1 D43.1 D44.1 D45.1 D46.1 P9.3 ; port 3
NetD47_1: D47.1 D48.1 D49.1 D50.1 D51.1 D52.1 D53.1 D54.1 D55.1 D56.1 D57.1 D58.1 D59.1 D60.1 D61.1 P9.4 ; port 4
NetD62_1: D62.1 D63.1 D64.1 D65.1 D66.1 D67.1 D68.1 D69.1 D70.1 D71.1 D72.1 D73.1 D74.1 D75.1 D76.1 P9.5 ; port 5
NetD77_1: D77.1 D78.1 D79.1 D80.1 D81.1 D82.1 D83.1 D84.1 D85.1 D86.1 D87.1 D88.1 D89.1 D90.1 D91.1 P9.6 ; port 6
NetD92_1: D92.1 D93.1 D94.1 D95.1 D96.1 D97.1 D98.1 D99.1 D100.1 D101.1 D102.1 D103.1 D104.1 D105.1 D106.1 P9.7 ; port 7
NetD107_1: D107.1 D108.1 D109.1 D110.1 D111.1 D112.1 D113.1 D114.1 D115.1 D116.1 D117.1 D118.1 D119.1 D120.1 D121.1 P9.8 ; port 8
NetD122_1: D122.1 D123.1 D124.1 D125.1 D126.1 D127.1 D128.1 D129.1 D130.1 D131.1 D132.1 D133.1 D134.1 D135.1 D136.1 P9.9 ; port 9
NetD137_1: D137.1 D138.1 D139.1 D140.1 D141.1 D142.1 D143.1 D144.1 D145.1 D146.1 D147.1 D148.1 D149.1 D150.1 D151.1 P9.10 ; port 10
NetP6_1: P8.15 R35.2 ; port A
NetP6_2: P8.14 R36.2 ; port B
NetP6_3: P8.13 R37.2 ; port C
NetP6_4: P8.12 R38.2 ; port D
NetP6_5: P8.11 R39.2 ; port E
NetP6_6: P8.10 R40.2 ; port F
NetP6_7: P8.9 R41.2 ; port G
NetP6_8: P8.8 R42.2 ; port H
NetP6_9: P8.7 R43.2 ; port I
NetP6_10: P8.6 R44.2 ; port J
NetP6_11: P8.5 R45.2 ; port K
NetP6_12: P8.4 R46.2 ; port L
NetP6_13: P8.3 R47.2 ; port M
NetP6_14: P8.2 R48.2 ; port N
NetP6_15: P8.1 R49.2 ; port O

### Library data of the parts
D2-D151 = SML-LX0805YC-TR: LED YELLOW CLEAR SMD; Manufacturer: Lumex Opto/Components Inc.; Configuration: Standard; Current - Test: 20mA; Lens Color: Colorless; Lens Size: 1.40mm x 1.25mm; Lens Style: Rectangle with Flat Top; Millicandela Rating: 9mcd; Viewing Angle: 140°; Voltage - Forward (Vf) (Typ): 2.1V; Wavelength - Peak: 585nm; Part Number: SML-LX0805YC-TR; Color: Yellow; ComponentLink1Description: Datasheet; ComponentLink1URL: https://www.lumex.com/content/files/ProductAttachment/SML-LX0805YC-TR.pdf; ComponentLink2Description: DigiKey Link; ComponentLink2URL: http://digikey.com/product-detail/en/lumex-opto-components-inc/SML-LX0805YC-TR/67-2192-1-ND/4172836; Device Package: 0805 (2012 Metric); Height (Max): 1.20mm; LastUpdated: 9/2/2020 1:21:22 AM; Lens Transparency: Clear; Lifecycle Status: Active; Minimum Order: 1; Mounting Type: Surface Mount; Package / Case: 0805 (2012 Metric); Packaging: TapeAndReel; PartId: 39; Part Status: Active; Price: 0.06; Series: -; Size / Dimension: 2.00mm L x 1.25mm W; Supplier 1: DigiKey; Supplier Part Number 1: 67-2192-1-ND; Value: Yellow
P8 = Header 15: Header, 15-Pin; LatestRevisionDate: 17-Jul-2002; LatestRevisionNote: Re-released for DXP Platform.; Publisher: Altium Limited
P9 = Header 10: Header, 10-Pin; LatestRevisionDate: 17-Jul-2002; LatestRevisionNote: Re-released for DXP Platform.; Publisher: Altium Limited
R35-R49 = CRGCQ0603J68R: CRGCQ 0603 68R 5%; Manufacturer: TE Connectivity Passive Product; Power (Watts): 0.1W, 1/10W; Temperature Coefficient: ±200ppm/°C; Part Number: CRGCQ0603J68R; Value: 68 Ohms; ComponentLink1Description: Datasheet; ComponentLink1URL: https://www.te.com/commerce/DocumentDelivery/DDEController?Action=srchrtrv&DocNm=1773204-3&DocType=DS&DocLang=English; ComponentLink2Description: DigiKey Link; ComponentLink2URL: http://digikey.com/product-detail/en/te-connectivity-passive-product/CRGCQ0603J68R/A130084CT-ND/8577916; Composition: Thick Film; Device Package: 0603 (1608 Metric); Features: Automotive AEC-Q200, Moisture Resistant; Height - Seated (Max): 0.022" (0.55mm); LastUpdated: 9/2/2020 1:10:07 AM; Lifecycle Status: Active; Minimum Order: 1; Number of Terminations: 2; Operating Temperature: -55°C ~ 155°C; Package / Case: 0603 (1608 Metric); Packaging: CutTape; PartId: 13186; Part Status: Active; Price: 0.10; Ratings: AEC-Q200; Resistance: 68 Ohms; Series: CRGCQ; Size / Dimension: 0.063" L x 0.031" W (1.60mm x 0.80mm); Supplier 1: DigiKey; Supplier Part Number 1: A130084CT-ND; Supplier Device Package: 0603; Tolerance: ±5%

## Sheet Connectors.SchDoc
size A
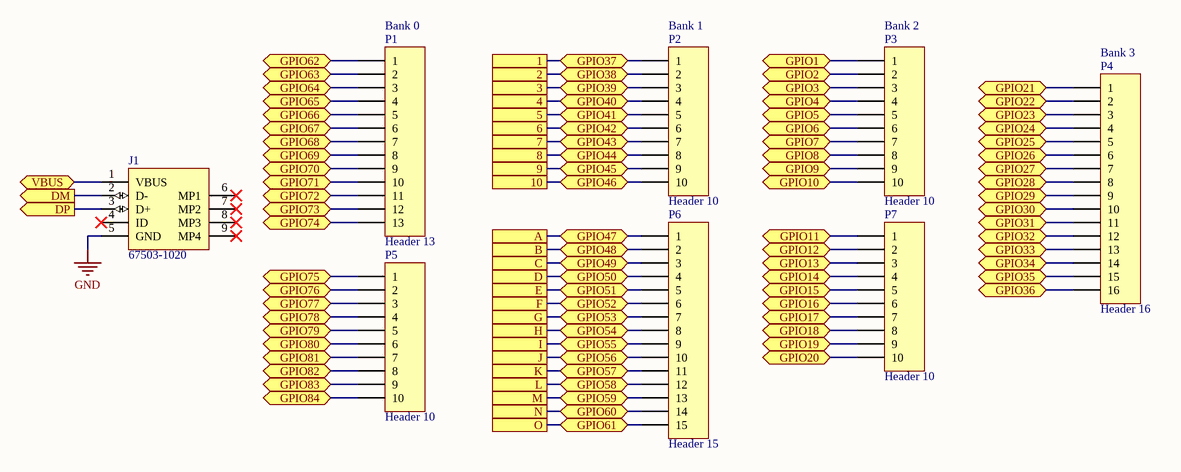
[diagram p4: Connectors.SchDoc]

### Parts
J1  67503-1020  [MOLX-67503-1020_V]
P1  Header 13  [HDR1X13]
P2  Header 10  [HDR1X10]
P3  Header 10  [HDR1X10]
P4  Header 16  [HDR1X16]
P5  Header 10  [HDR1X10]
P6  Header 15  [HDR1X15]
P7  Header 10  [HDR1X10]

### Ports
1, 2, 3, 4, 5, 6, 7, 8, 9, 10, A, B, C, D, DM (out), DP (out), E, F, G, GPIO1 (bidir), GPIO2 (bidir), GPIO3 (bidir), GPIO4 (bidir), GPIO5 (bidir), GPIO6 (bidir), GPIO7 (bidir), GPIO8 (bidir), GPIO9 (bidir), GPIO10 (bidir), GPIO11 (bidir), GPIO12 (bidir), GPIO13 (bidir), GPIO14 (bidir), GPIO15 (bidir), GPIO16 (bidir), GPIO17 (bidir), GPIO18 (bidir), GPIO19 (bidir), GPIO20 (bidir), GPIO21 (bidir), GPIO22 (bidir), GPIO23 (bidir), GPIO24 (bidir), GPIO25 (bidir), GPIO26 (bidir), GPIO27 (bidir), GPIO28 (bidir), GPIO29 (bidir), GPIO30 (bidir), GPIO31 (bidir), GPIO32 (bidir), GPIO33 (bidir), GPIO34 (bidir), GPIO35 (bidir), GPIO36 (bidir), GPIO37 (bidir), GPIO38 (bidir), GPIO39 (bidir), GPIO40 (bidir), GPIO41 (bidir), GPIO42 (bidir), GPIO43 (bidir), GPIO44 (bidir), GPIO45 (bidir), GPIO46 (bidir), GPIO47 (bidir), GPIO48 (bidir), GPIO49 (bidir), GPIO50 (bidir), GPIO51 (bidir), GPIO52 (bidir), GPIO53 (bidir), GPIO54 (bidir), GPIO55 (bidir), GPIO56 (bidir), GPIO57 (bidir), GPIO58 (bidir), GPIO59 (bidir), GPIO60 (bidir), GPIO61 (bidir), GPIO62 (bidir), GPIO63 (bidir), GPIO64 (bidir), GPIO65 (bidir), GPIO66 (bidir), GPIO67 (bidir), GPIO68 (bidir), GPIO69 (bidir), GPIO70 (bidir), GPIO71 (bidir), GPIO72 (bidir), GPIO73 (bidir), GPIO74 (bidir), GPIO75 (bidir), GPIO76 (bidir), GPIO77 (bidir), GPIO78 (bidir), GPIO79 (bidir), GPIO80 (bidir), GPIO81 (bidir), GPIO82 (bidir), GPIO83 (bidir), GPIO84 (bidir), H, I, J, K, L, M, N, O, VBUS (bidir)

### Nets
GND: J1.5(GND)
NetC12_2: J1.1(VBUS) ; port VBUS
NetD2_1: P2.1 ; port GPIO37, port 1
NetD17_1: P2.2 ; port GPIO38, port 2
NetD32_1: P2.3 ; port GPIO39, port 3
NetD47_1: P2.4 ; port GPIO40, port 4
NetD62_1: P2.5 ; port GPIO41, port 5
NetD77_1: P2.6 ; port GPIO42, port 6
NetD92_1: P2.7 ; port GPIO43, port 7
NetD107_1: P2.8 ; port GPIO44, port 8
NetD122_1: P2.9 ; port GPIO45, port 9
NetD137_1: P2.10 ; port GPIO46, port 10
NetJ1_2: J1.2(D-) ; port DM
NetJ1_3: J1.3(D+) ; port DP
NetP1_1: P1.1 ; port GPIO62
NetP1_2: P1.2 ; port GPIO63
NetP1_3: P1.3 ; port GPIO64
NetP1_4: P1.4 ; port GPIO65
NetP1_5: P1.5 ; port GPIO66
NetP1_6: P1.6 ; port GPIO67
NetP1_7: P1.7 ; port GPIO68
NetP1_8: P1.8 ; port GPIO69
NetP1_9: P1.9 ; port GPIO70
NetP1_10: P1.10 ; port GPIO71
NetP1_11: P1.11 ; port GPIO72
NetP1_12: P1.12 ; port GPIO73
NetP1_13: P1.13 ; port GPIO74
NetP3_1: P3.1 ; port GPIO1
NetP3_2: P3.2 ; port GPIO2
NetP3_3: P3.3 ; port GPIO3
NetP3_4: P3.4 ; port GPIO4
NetP3_5: P3.5 ; port GPIO5
NetP3_6: P3.6 ; port GPIO6
NetP3_7: P3.7 ; port GPIO7
NetP3_8: P3.8 ; port GPIO8
NetP3_9: P3.9 ; port GPIO9
NetP3_10: P3.10 ; port GPIO10
NetP4_1: P4.1 ; port GPIO21
NetP4_2: P4.2 ; port GPIO22
NetP4_3: P4.3 ; port GPIO23
NetP4_4: P4.4 ; port GPIO24
NetP4_5: P4.5 ; port GPIO25
NetP4_6: P4.6 ; port GPIO26
NetP4_7: P4.7 ; port GPIO27
NetP4_8: P4.8 ; port GPIO28
NetP4_9: P4.9 ; port GPIO29
NetP4_10: P4.10 ; port GPIO30
NetP4_11: P4.11 ; port GPIO31
NetP4_12: P4.12 ; port GPIO32
NetP4_13: P4.13 ; port GPIO33
NetP4_14: P4.14 ; port GPIO34
NetP4_15: P4.15 ; port GPIO35
NetP4_16: P4.16 ; port GPIO36
NetP5_1: P5.1 ; port GPIO75
NetP5_2: P5.2 ; port GPIO76
NetP5_3: P5.3 ; port GPIO77
NetP5_4: P5.4 ; port GPIO78
NetP5_5: P5.5 ; port GPIO79
NetP5_6: P5.6 ; port GPIO80
NetP5_7: P5.7 ; port GPIO81
NetP5_8: P5.8 ; port GPIO82
NetP5_9: P5.9 ; port GPIO83
NetP5_10: P5.10 ; port GPIO84
NetP6_1: P6.1 ; port GPIO47, port A
NetP6_2: P6.2 ; port GPIO48, port B
NetP6_3: P6.3 ; port GPIO49, port C
NetP6_4: P6.4 ; port GPIO50, port D
NetP6_5: P6.5 ; port GPIO51, port E
NetP6_6: P6.6 ; port GPIO52, port F
NetP6_7: P6.7 ; port GPIO53, port G
NetP6_8: P6.8 ; port GPIO54, port H
NetP6_9: P6.9 ; port GPIO55, port I
NetP6_10: P6.10 ; port GPIO56, port J
NetP6_11: P6.11 ; port GPIO57, port K
NetP6_12: P6.12 ; port GPIO58, port L
NetP6_13: P6.13 ; port GPIO59, port M
NetP6_14: P6.14 ; port GPIO60, port N
NetP6_15: P6.15 ; port GPIO61, port O
NetP7_1: P7.1 ; port GPIO11
NetP7_2: P7.2 ; port GPIO12
NetP7_3: P7.3 ; port GPIO13
NetP7_4: P7.4 ; port GPIO14
NetP7_5: P7.5 ; port GPIO15
NetP7_6: P7.6 ; port GPIO16
NetP7_7: P7.7 ; port GPIO17
NetP7_8: P7.8 ; port GPIO18
NetP7_9: P7.9 ; port GPIO19
NetP7_10: P7.10 ; port GPIO20

Not connected (* = marked no-connect by the designer): J1 4(ID)* 6(MP1)* 7(MP2)* 8(MP3)* 9(MP4)*

### Notes on the sheet
- (near P1) Bank 0
- (near P2) Bank 1
- (near P3) Bank 2
- (near P4) Bank 3

### Library data of the parts
J1 = CMP-0411-00002-1: USB, MINI, SMD, RA KME04-USBMU03A01; Manufacturer: Molex; ComponentLink1URL: http://www.molex.com/; PartNumber: 67503-1020; Mounting Technology: Surface Mount; ComponentLink1Description: Manufacturer URL; Terminal Pitch: 0.8 mm; DatasheetVersion: Rev F, 06/2009; ComponentLink2Description: Datasheet; PackageDescription: Mini USB Connector, SMT, Righer Angle; ComponentLink2URL: http://www.molex.com/pdm_docs/sd/675031020_sd.pdf; PackageReference: 67503-1020
P1 = Header 13: Header, 13-Pin; LatestRevisionDate: 17-Jul-2002; LatestRevisionNote: Re-released for DXP Platform.; Publisher: Altium Limited
P2 P3 P5 P7 = Header 10: Header, 10-Pin; LatestRevisionDate: 17-Jul-2002; LatestRevisionNote: Re-released for DXP Platform.; Publisher: Altium Limited
P4 = Header 16: Header, 16-Pin; LatestRevisionDate: 17-Jul-2002; LatestRevisionNote: Re-released for DXP Platform.; Publisher: Altium Limited
P6 = Header 15: Header, 15-Pin; LatestRevisionDate: 17-Jul-2002; LatestRevisionNote: Re-released for DXP Platform.; Publisher: Altium Limited